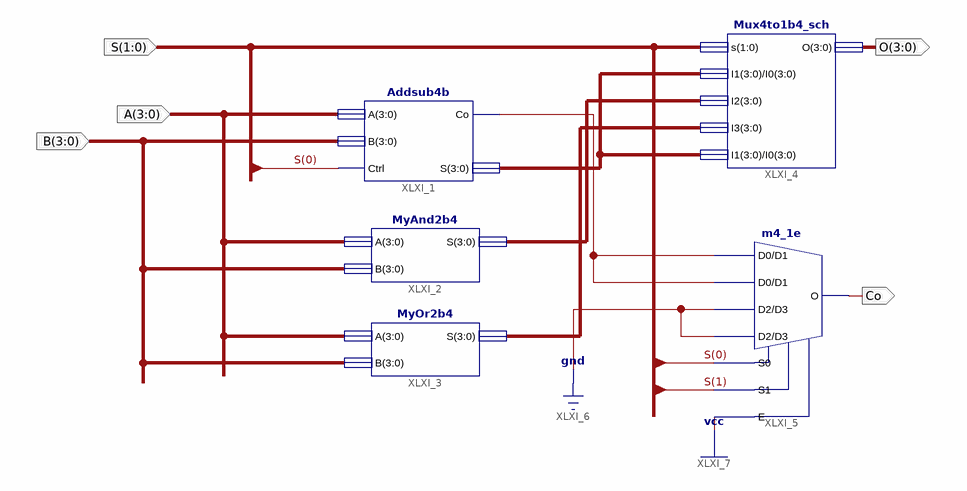
[diagram p0: schematic sheet 1]
// Xilinx ISE schematic ALU4b.sch (kintex7) as structural Verilog: 5 symbols, 5 ports
module ALU4b (
  input  [3:0] A,
  input  [3:0] B,
  input  [1:0] S,
  output [3:0] O,
  output Co
);

  wire XLXN_6;
  wire [3:0] XLXN_15, XLXN_17, XLXN_18;

  Addsub4b XLXI_1 (.A(A), .B(B), .Ctrl(S[0]), .Co(XLXN_6), .S(XLXN_15));
  MyAnd2b4 XLXI_2 (.A(A), .B(B), .S(XLXN_17));
  MyOr2b4 XLXI_3 (.A(A), .B(B), .S(XLXN_18));
  Mux4to1b4_sch XLXI_4 (.s(S), .I1(XLXN_15), .I2(XLXN_17), .I3(XLXN_18), .I0(XLXN_15), .O(O));
  m4_1e XLXI_5 (.D0(XLXN_6), .D1(XLXN_6), .D2(1'b0), .D3(1'b0), .E(1'b1), .S0(S[0]), .S1(S[1]), .O(Co));
endmodule
